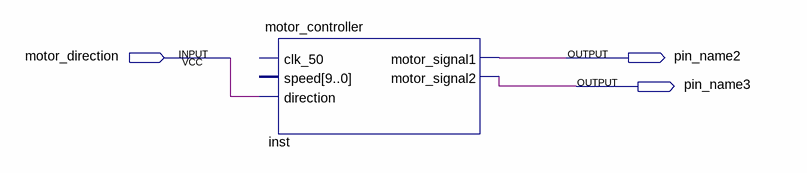
[diagram p0: schematic sheet]
// Quartus schematic motor_controller.bdf as structural Verilog: 1 symbols, 3 pins
module motor_controller (
  input  motor_direction,
  output pin_name2,
  output pin_name3
);

  motor_controller inst (
    .direction(motor_direction), .motor_signal1(pin_name2), .motor_signal2(pin_name3));  // open: clk_50, speed
endmodule
